# Altium schematic sheet Sheet3.SchDoc
size A4; SheetNumber: 3; SheetTotal: 4
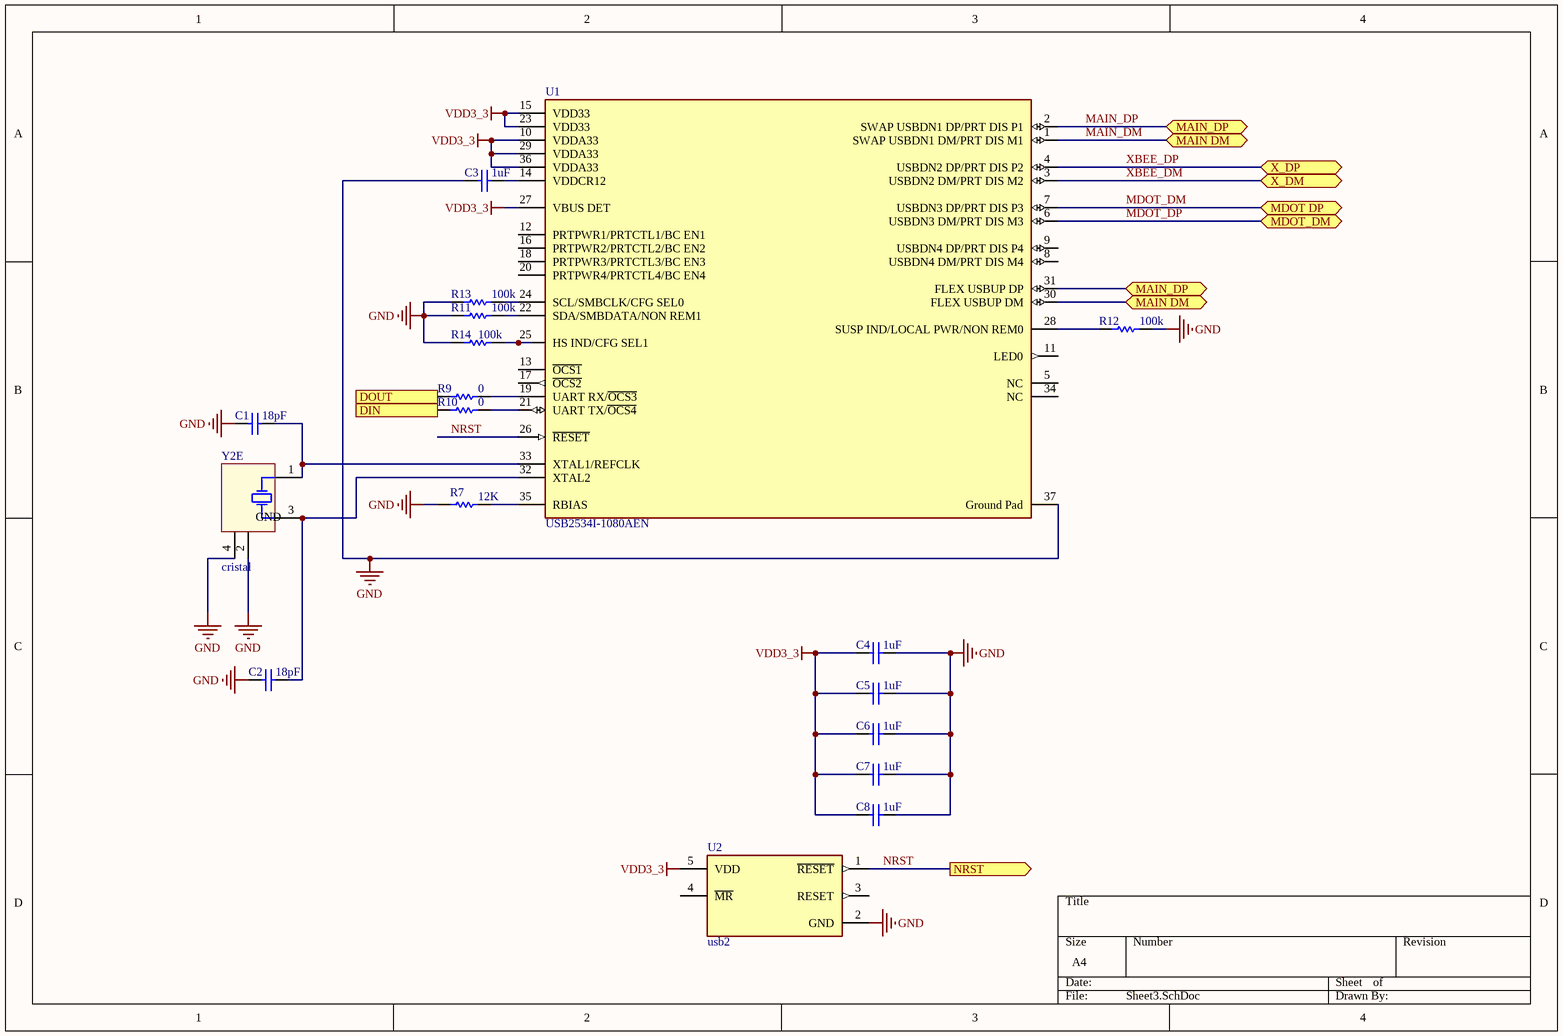
[diagram p0: Sheet3.SchDoc]

## Parts
C1  value 18pF  [CAPC1005X35N]  (hidden comment: Cap)
C2  value 18pF  [CAPC1005X35N]  (hidden comment: Cap)
C3  value 1uF  [CAPC1005X35N]  (hidden comment: Cap)
C4  value 1uF  [CAPC1005X35N]  (hidden comment: Cap)
C5  value 1uF  [CAPC1005X35N]  (hidden comment: Cap)
C6  value 1uF  [CAPC1005X35N]  (hidden comment: Cap)
C7  value 1uF  [CAPC1005X35N]  (hidden comment: Cap)
C8  value 1uF  [CAPC1005X35N]  (hidden comment: Cap)
R7  value 12K  [RESC1005X35N]  (hidden comment: Res1)
R9  value 0  [RESC1005X35N]  (hidden comment: Res1)
R10  value 0  [RESC1005X35N]  (hidden comment: Res1)
R11  value 100k  [RESC1005X35N]  (hidden comment: Res1)
R12  value 100k  [RESC1005X35N]  (hidden comment: Res1)
R13  value 100k  [RESC1005X35N]  (hidden comment: Res1)
R14  value 100k  [RESC1005X35N]  (hidden comment: Res1)
U1  USB2534I-1080AEN  [FP-36SQFN-3706-6x6B-IPC_A]
U2  usb2  [FP-DBV0005A-IPC_A]
Y2  cristal  [ABRA-ABMM2-4_V]  (part E of 5)

## Ports
DIN (out), DOUT (in), MAIN DM (bidir), MAIN_DP (bidir), MDOT DP (bidir), MDOT_DM (bidir), NRST (out), X_DM (bidir), X_DP (bidir)

## Nets
GND: C1.2 C2.2 C3.2 C4.1 C5.1 C6.1 C7.1 C8.1 R7.1 R11.1 R12.2 R13.1 R14.1 U1.37(Ground_Pad) U2.2(GND) Y2.2(GND) Y2.4(GND)
VDD3_3: C4.2 C5.2 C6.2 C7.2 C8.2 U1.10(VDDA33) U1.15(VDD33) U1.23(VDD33) U1.27(VBUS_DET) U1.29(VDDA33) U1.36(VDDA33) U2.5(VDD)
DIN: R10.1 ; port DIN
DOUT: R9.1 ; port DOUT
MAIN_DM: U1.1(SWAP_USBDN1_DM/PRT_DIS_M1) U1.30(FLEX_USBUP_DM) ; port MAIN DM
MAIN_DP: U1.2(SWAP_USBDN1_DP/PRT_DIS_P1) U1.31(FLEX_USBUP_DP) ; port MAIN_DP
MDOT_DM: U1.7(USBDN3_DP/PRT_DIS_P3) ; port MDOT DP
MDOT_DP: U1.6(USBDN3_DM/PRT_DIS_M3) ; port MDOT_DM
NRST: U1.26(~{RESET}) U2.1(~{RESET}) ; port NRST
XBEE_DM: U1.3(USBDN2_DM/PRT_DIS_M2) ; port X_DM
XBEE_DP: U1.4(USBDN2_DP/PRT_DIS_P2) ; port X_DP
NetC1_1: C1.1 U1.33(XTAL1/REFCLK) Y2.1(X1)
NetC2_1: C2.1 U1.32(XTAL2) Y2.3(X2)
NetC3_1: C3.1 U1.14(VDDCR12)
NetR7_2: R7.2 U1.35(RBIAS)
NetR9_2: R9.2 U1.19(UART_RX/~{OCS3})
NetR10_2: R10.2 U1.21(UART_TX/~{OCS4})
NetR11_2: R11.2 U1.22(SDA/SMBDATA/NON_REM1)
NetR12_1: R12.1 U1.28(SUSP_IND/LOCAL_PWR/NON_REM0)
NetR13_2: R13.2 U1.24(SCL/SMBCLK/CFG_SEL0)
NetR14_2: R14.2 U1.25(HS_IND/CFG_SEL1)

Not connected (* = marked no-connect by the designer): U1 5(NC) 8(USBDN4_DM/PRT_DIS_M4) 9(USBDN4_DP/PRT_DIS_P4) 11(LED0) 12(PRTPWR1/PRTCTL1/BC_EN1) 13(~{OCS1}) 16(PRTPWR2/PRTCTL2/BC_EN2) 17(~{OCS2}) 18(PRTPWR3/PRTCTL3/BC_EN3) 20(PRTPWR4/PRTCTL4/BC_EN4) 34(NC); U2 3(RESET) 4(~{MR})

## Library data of the parts
C1-C8 = Cap: Capacitor; Published: 8-Jun-2000; LatestRevisionDate: 17-Jul-2002; LatestRevisionNote: Re-released for DXP Platform.; PackageReference: RAD-0.3; Publisher: Altium Limited; PackageDescription: Radial Cap, Thru-Hole; 2 Leads; 0.3 in Pin Spacing
R7 R9-R14 = Res1: Resistor; Published: 8-Jun-2000; LatestRevisionDate: 17-Jul-2002; LatestRevisionNote: Re-released for DXP Platform.; PackageReference: AXIAL-0.3; Publisher: Altium Limited; PackageDescription: Axial Device, Thru-Hole; 2 Leads; 0.3 in Pin Spacing
U1 = CMP-06284-000029-1: IC USB 2.0 HUB CTLR 4PORT 36SQFN; Manufacturer: Microchip; Max Supply Voltage: 3.6V; Operating Supply Voltage: 3.3V; Number of Ports: 4; ESD Protection: Yes; Interface: I2C; Number of Transceivers: 1; Min Supply Voltage: 3V; Radiation Hardening: No; Packaging: Tray; Height: 0.95mm; Package Quantity: 490; Min Operating Temperature: -40°C; REACH SVHC: No SVHC; Lead Free: Lead Free; Mount: Surface Mount; Number of Channels: 4; Max Operating Temperature: 85°C; Width: 6.1mm; Number of Pins: 36; RoHS Compliant: Yes; Length: 6.1mm; Manufacturer Part Number: USB2534I-1080AEN